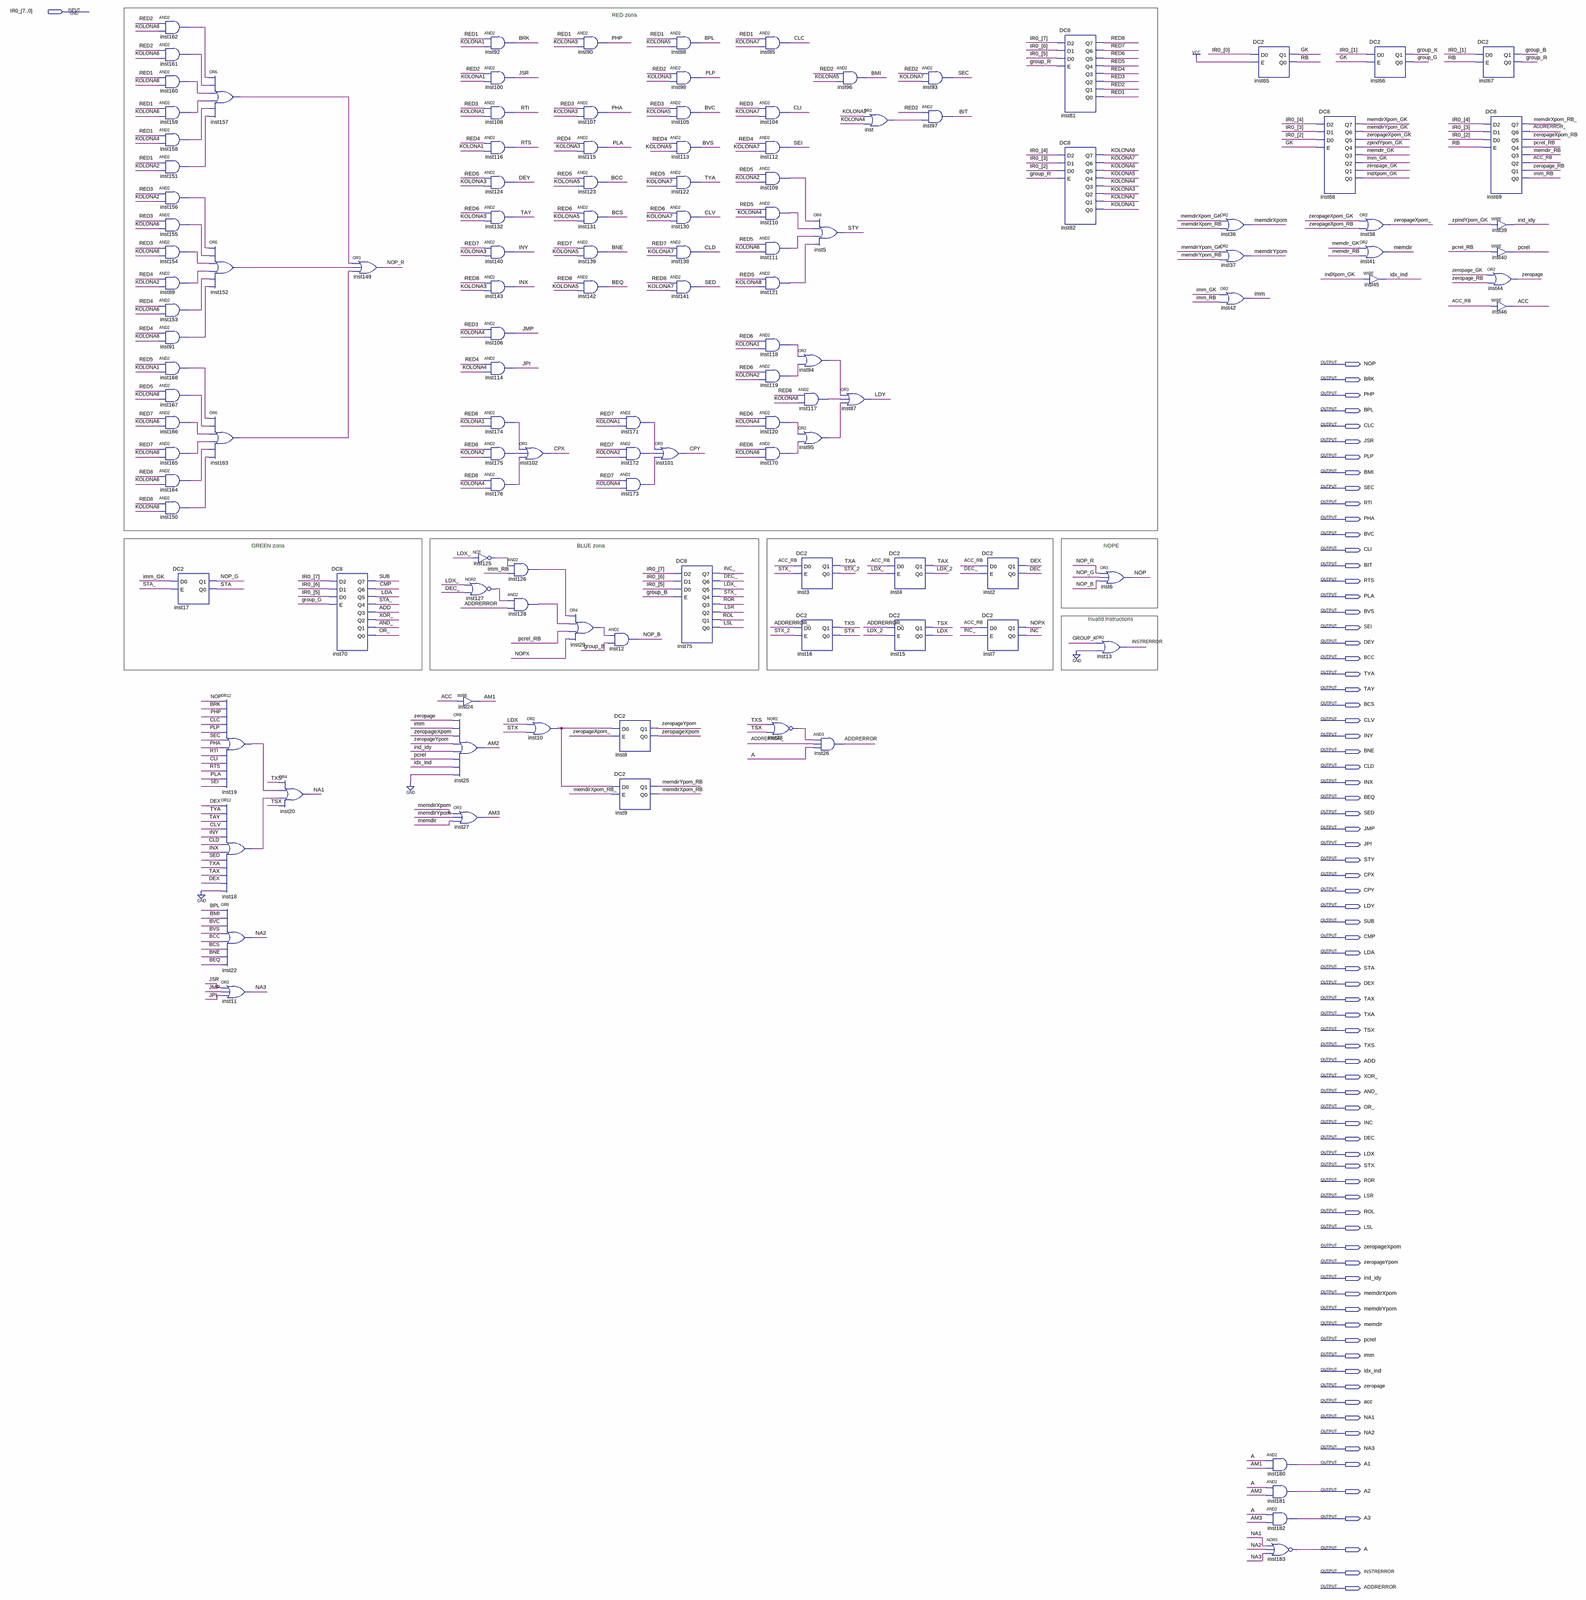
[diagram p0: schematic sheet, whole]
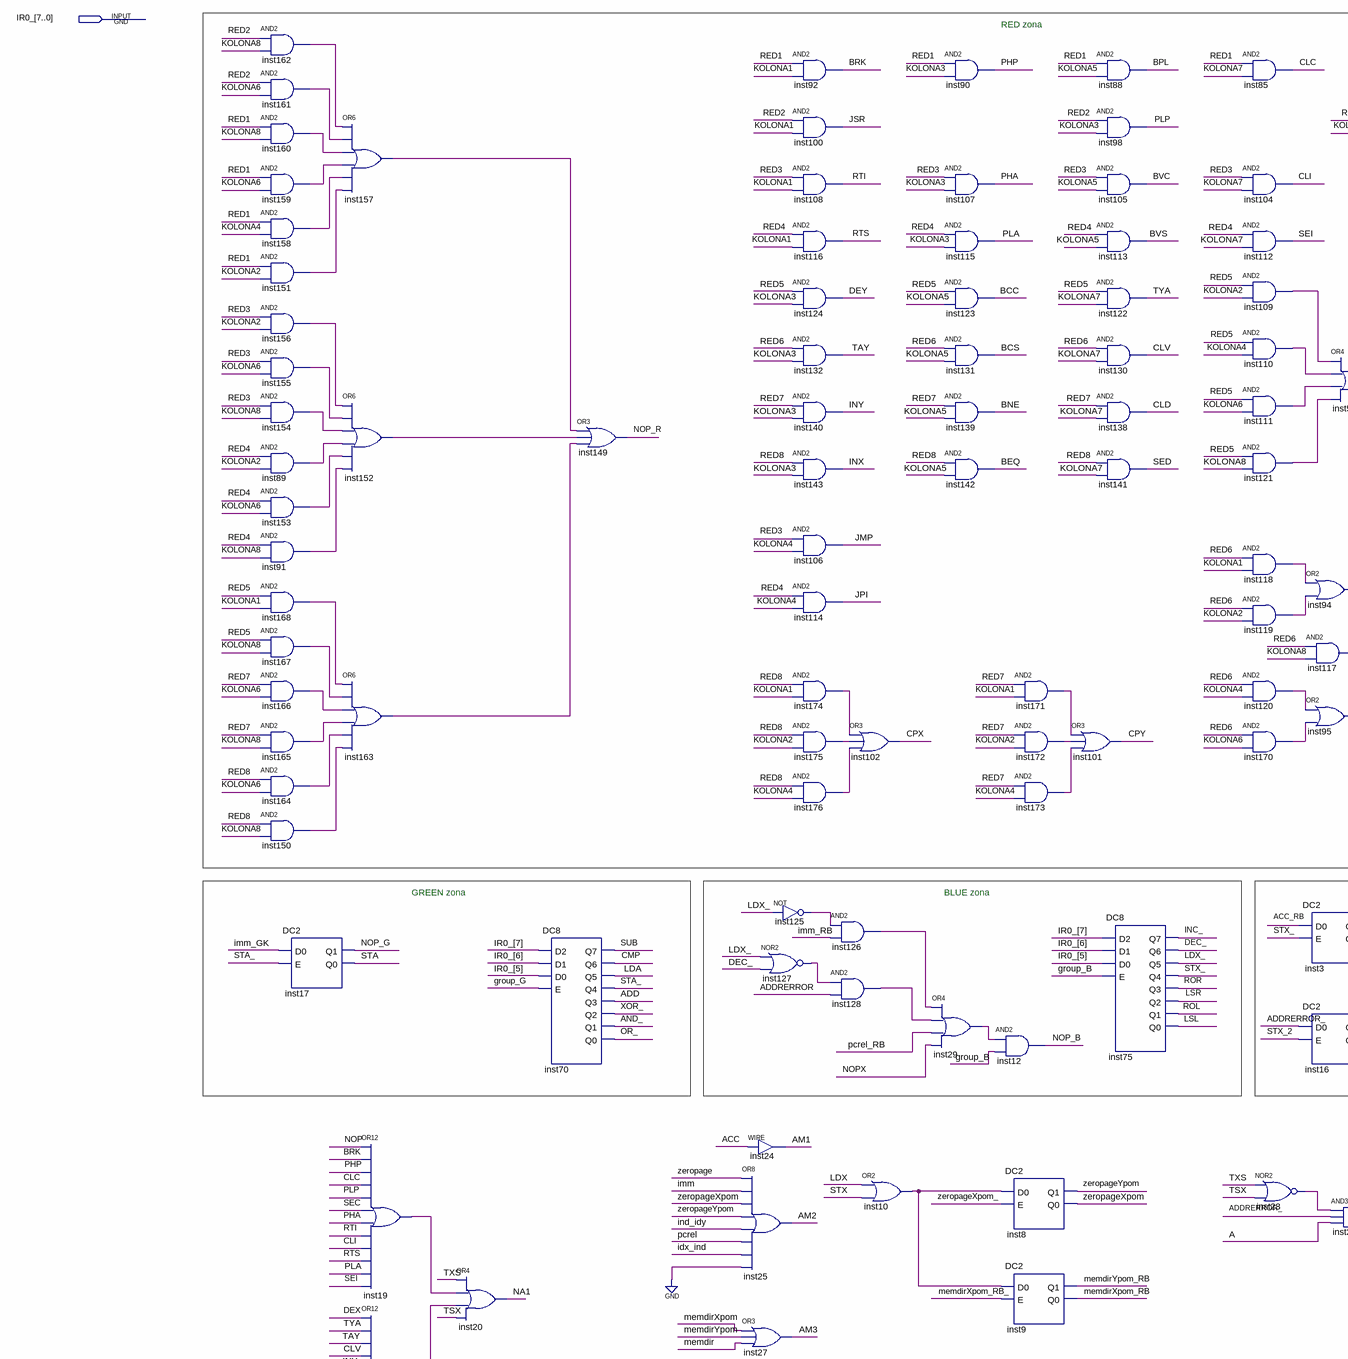
[diagram p1: schematic sheet, upper left part]
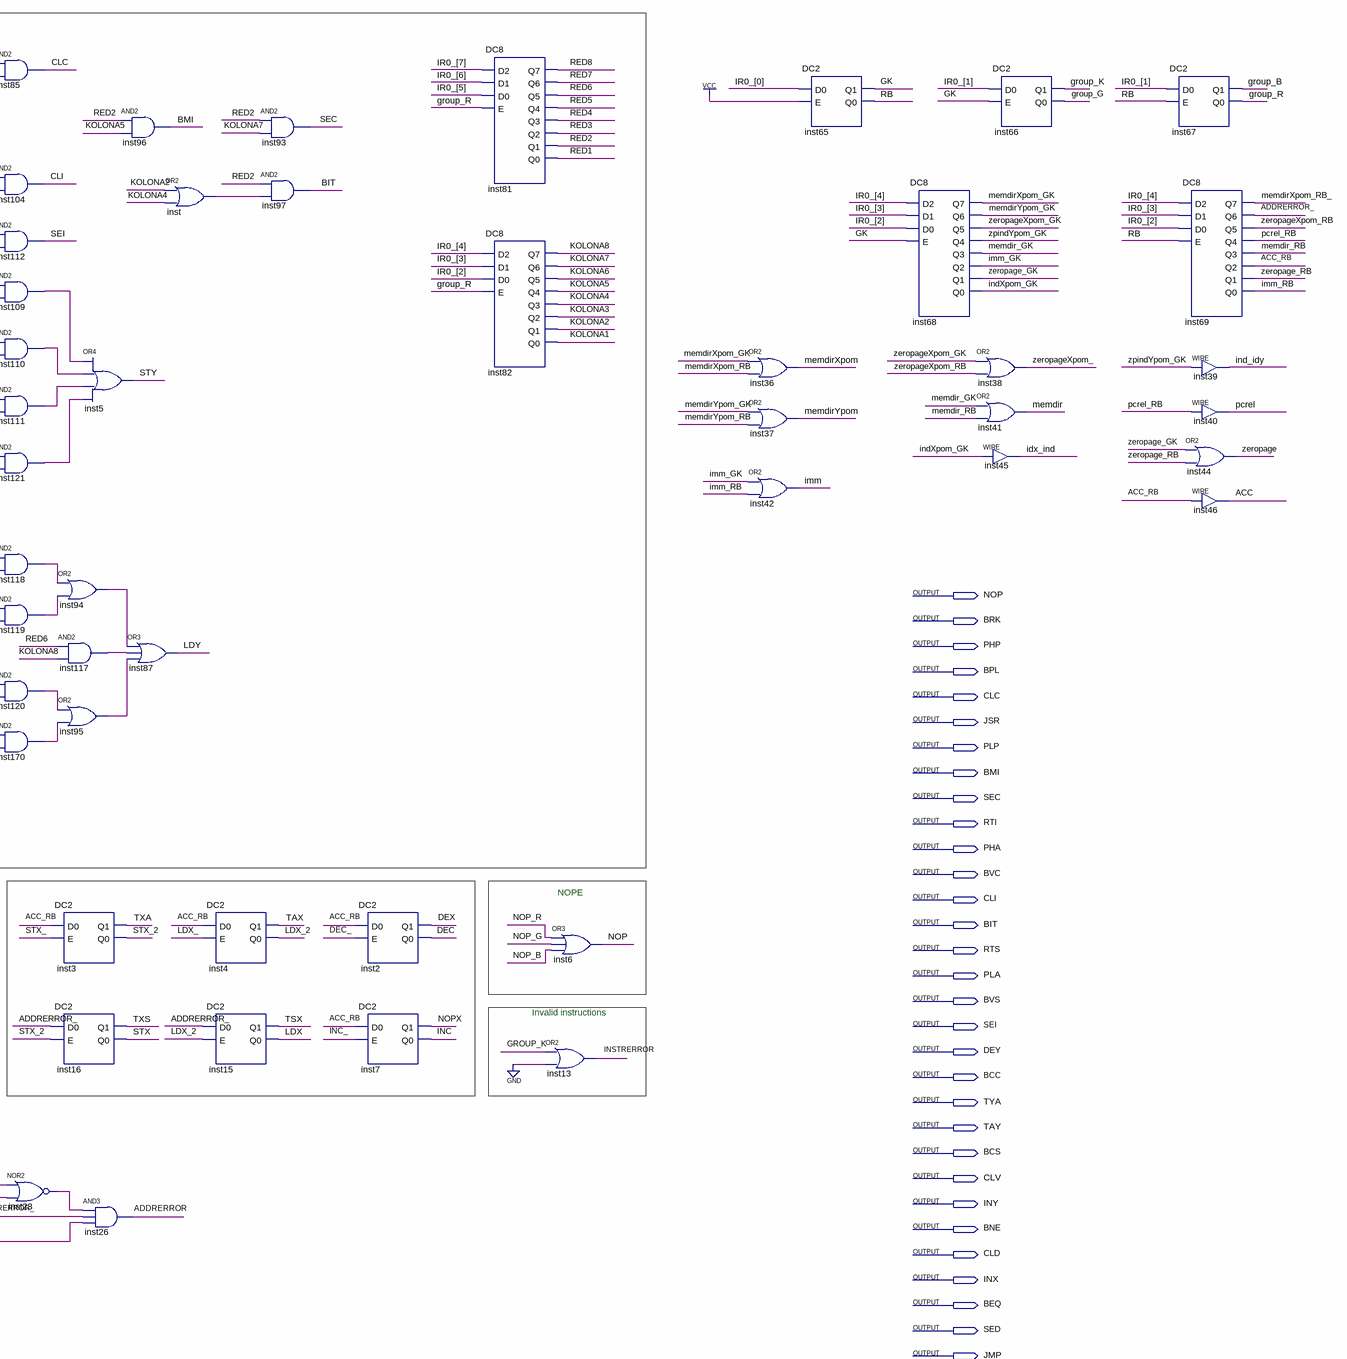
[diagram p2: schematic sheet, upper right part]
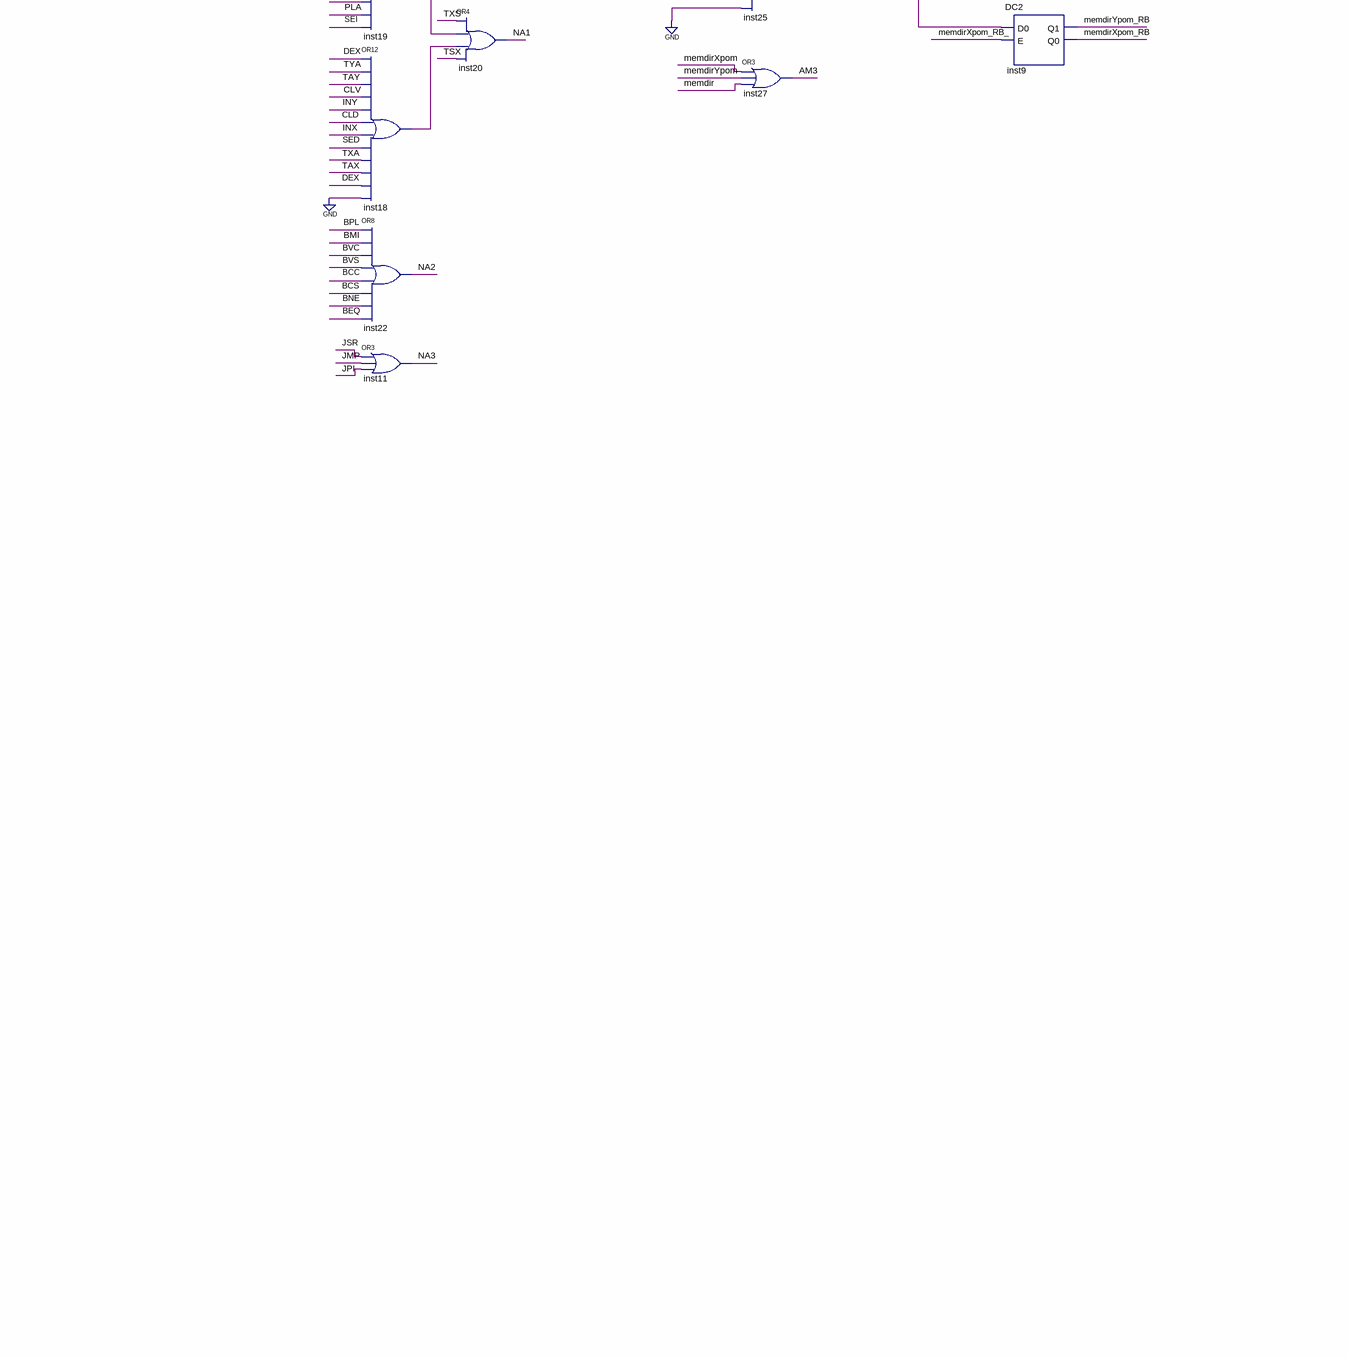
[diagram p3: schematic sheet, lower left part]
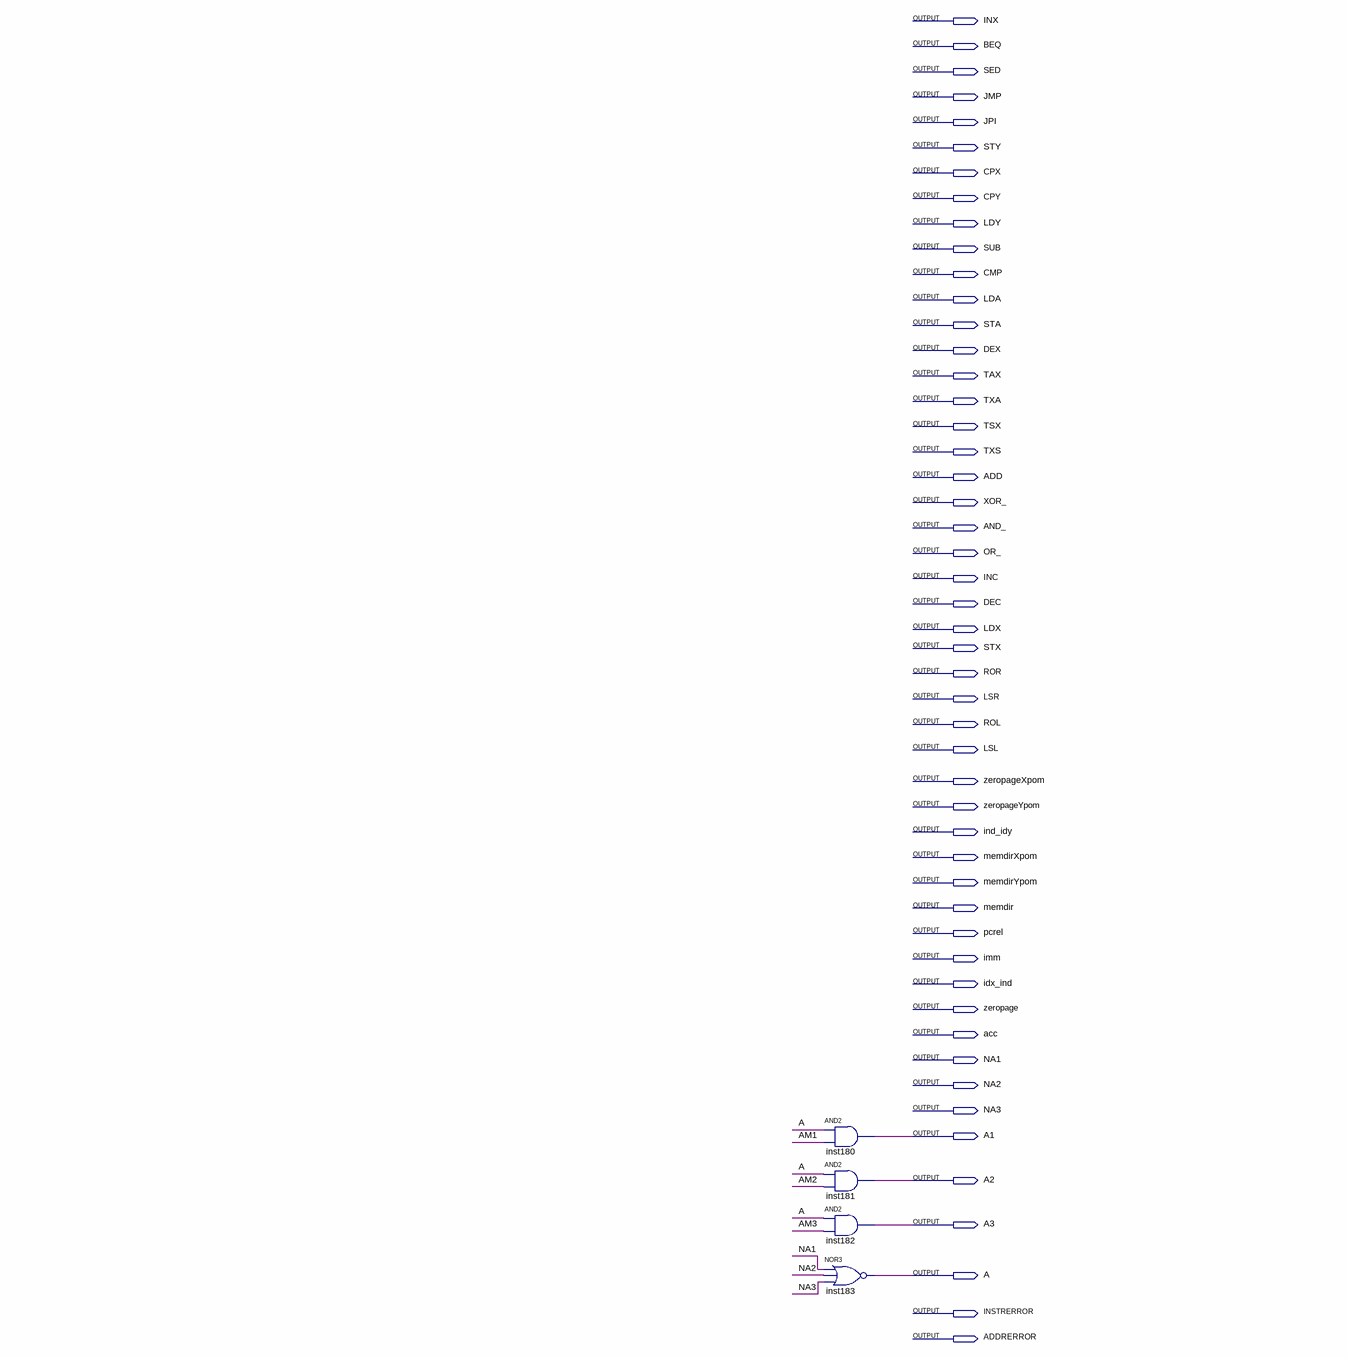
[diagram p4: schematic sheet, lower right part]
// Quartus schematic cpu_decode.bdf as structural Verilog: 126 symbols, 78 pins
module cpu_decode (
  input  [7:0] IR0_,
  output NOP,
  output BRK,
  output PHP,
  output BPL,
  output CLC,
  output JSR,
  output PLP,
  output BMI,
  output SEC,
  output RTI,
  output PHA,
  output BVC,
  output CLI,
  output BIT,
  output RTS,
  output PLA,
  output BVS,
  output SEI,
  output DEY,
  output BCC,
  output TYA,
  output TAY,
  output BCS,
  output CLV,
  output INY,
  output BNE,
  output CLD,
  output INX,
  output BEQ,
  output SED,
  output JMP,
  output JPI,
  output STY,
  output CPX,
  output CPY,
  output LDY,
  output SUB,
  output CMP,
  output LDA,
  output STA,
  output DEX,
  output TAX,
  output TXA,
  output TSX,
  output TXS,
  output ADD,
  output XOR_,
  output AND_,
  output OR_,
  output INC,
  output DEC,
  output LDX,
  output STX,
  output ROR,
  output LSR,
  output ROL,
  output LSL,
  output zeropageXpom,
  output zeropageYpom,
  output ind_idy,
  output memdirXpom,
  output memdirYpom,
  output memdir,
  output pcrel,
  output imm,
  output idx_ind,
  output zeropage,
  output acc,
  output NA1,
  output NA2,
  output NA3,
  output A1,
  output A2,
  output A3,
  output A,
  output INSTRERROR,
  output ADDRERROR
);

  wire ACC_RB, ADDRERROR_, AM1, AM2, AM3, DEC_, GK, group_B, group_G, group_K, group_R, imm_GK, imm_RB, INC_,
       indXpom_GK, inst10_out, inst18_out, inst19_out, inst23_out, inst29_out, inst89_out, inst91_out,
       inst94_out, inst95_out, inst109_out, inst110_out, inst111_out, inst117_out, inst118_out, inst119_out,
       inst120_out, inst121_out, inst125_out, inst126_out, inst127_out, inst128_out, inst150_out,
       inst151_out, inst152_out, inst153_out, inst154_out, inst155_out, inst156_out, inst157_out,
       inst158_out, inst159_out, inst160_out, inst161_out, inst162_out, inst163_out, inst164_out,
       inst165_out, inst166_out, inst167_out, inst168_out, inst170_out, inst171_out, inst172_out,
       inst173_out, inst174_out, inst175_out, inst176_out, inst_out, KOLONA1, KOLONA2, KOLONA3, KOLONA4,
       KOLONA5, KOLONA6, KOLONA7, KOLONA8, LDX_, LDX_2, memdir_GK, memdir_RB, memdirXpom_GK, memdirXpom_RB,
       memdirXpom_RB_, memdirYpom_GK, memdirYpom_RB, NOP_B, NOP_G, NOP_R, NOPX, pcrel_RB, RB, RED1, RED2,
       RED3, RED4, RED5, RED6, RED7, RED8, STA_, STX_, STX_2, zeropage_GK, zeropage_RB, zeropageXpom_,
       zeropageXpom_GK, zeropageXpom_RB, zpindYpom_GK;

  and inst162 (inst162_out, RED2, KOLONA8);
  and inst161 (inst161_out, RED2, KOLONA6);
  and inst160 (inst160_out, RED1, KOLONA8);
  and inst159 (inst159_out, RED1, KOLONA6);
  and inst158 (inst158_out, RED1, KOLONA4);
  and inst151 (inst151_out, RED1, KOLONA2);
  and inst156 (inst156_out, RED3, KOLONA2);
  and inst155 (inst155_out, RED3, KOLONA6);
  and inst154 (inst154_out, RED3, KOLONA8);
  and inst89 (inst89_out, RED4, KOLONA2);
  and inst153 (inst153_out, RED4, KOLONA6);
  and inst91 (inst91_out, RED4, KOLONA8);
  and inst168 (inst168_out, RED5, KOLONA1);
  and inst167 (inst167_out, RED5, KOLONA8);
  and inst166 (inst166_out, RED7, KOLONA6);
  and inst165 (inst165_out, RED7, KOLONA8);
  and inst164 (inst164_out, RED8, KOLONA6);
  and inst150 (inst150_out, RED8, KOLONA8);
  DC2 inst17 (.D0(imm_GK), .E(STA_), .Q1(NOP_G), .Q0(STA));
  or inst157 (inst157_out, inst162_out, inst161_out, inst160_out, inst159_out, inst158_out, inst151_out);
  or inst152 (inst152_out, inst156_out, inst155_out, inst154_out, inst89_out, inst153_out, inst91_out);
  or inst163 (inst163_out, inst168_out, inst167_out, inst166_out, inst165_out, inst164_out, inst150_out);
  or inst19 (inst19_out, NOP, BRK, PHP, CLC, PLP, SEC, PHA, RTI, CLI, RTS, PLA, SEI);
  or inst18 (inst18_out, DEX, TYA, TAY, CLV, INY, CLD, INX, SED, TXA, TAX, DEX, 1'b0);
  or inst22 (NA2, BPL, BMI, BVC, BVS, BCC, BCS, BNE, BEQ);
  or inst11 (NA3, JSR, JMP, JPI);
  or inst20 (NA1, TXS, inst19_out, inst18_out, TSX);
  DC8 inst70 (
    .D2(IR0_[7]), .D1(IR0_[6]), .D0(IR0_[5]), .E(group_G), .Q7(SUB), .Q6(CMP), .Q5(LDA), .Q4(STA_), .Q3(ADD),
    .Q2(XOR_), .Q1(AND_), .Q0(OR_));
  or inst149 (NOP_R, inst157_out, inst152_out, inst163_out);
  or inst25 (AM2, zeropage, imm, zeropageXpom, zeropageYpom, ind_idy, pcrel, idx_ind, 1'b0);
  or inst27 (AM3, memdirXpom, memdirYpom, memdir);
  and inst92 (BRK, RED1, KOLONA1);
  and inst100 (JSR, RED2, KOLONA1);
  and inst108 (RTI, RED3, KOLONA1);
  and inst116 (RTS, RED4, KOLONA1);
  and inst124 (DEY, RED5, KOLONA3);
  and inst132 (TAY, RED6, KOLONA3);
  and inst140 (INY, RED7, KOLONA3);
  and inst143 (INX, RED8, KOLONA3);
  and inst106 (JMP, RED3, KOLONA4);
  and inst114 (JPI, RED4, KOLONA4);
  and inst174 (inst174_out, RED8, KOLONA1);
  and inst175 (inst175_out, RED8, KOLONA2);
  and inst176 (inst176_out, RED8, KOLONA4);
  not inst125 (inst125_out, LDX_);
  nor inst127 (inst127_out, LDX_, DEC_);
  assign AM1 = acc;  // WIRE inst24
  and inst126 (inst126_out, inst125_out, imm_RB);
  and inst128 (inst128_out, inst127_out, ADDRERROR);
  or inst102 (CPX, inst174_out, inst175_out, inst176_out);
  or inst10 (inst10_out, LDX, STX);
  and inst90 (PHP, RED1, KOLONA3);
  and inst107 (PHA, RED3, KOLONA3);
  and inst115 (PLA, RED4, KOLONA3);
  and inst123 (BCC, RED5, KOLONA5);
  and inst131 (BCS, RED6, KOLONA5);
  and inst139 (BNE, RED7, KOLONA5);
  and inst142 (BEQ, RED8, KOLONA5);
  or inst29 (inst29_out, inst126_out, inst128_out, pcrel_RB, NOPX);
  and inst12 (NOP_B, inst29_out, group_B);
  and inst171 (inst171_out, RED7, KOLONA1);
  and inst172 (inst172_out, RED7, KOLONA2);
  and inst173 (inst173_out, RED7, KOLONA4);
  DC2 inst8 (.D0(inst10_out), .E(zeropageXpom_), .Q1(zeropageYpom), .Q0(zeropageXpom));
  DC2 inst9 (.D0(inst10_out), .E(memdirXpom_RB_), .Q1(memdirYpom_RB), .Q0(memdirXpom_RB));
  and inst88 (BPL, RED1, KOLONA5);
  and inst98 (PLP, RED2, KOLONA3);
  and inst105 (BVC, RED3, KOLONA5);
  and inst113 (BVS, RED4, KOLONA5);
  and inst122 (TYA, RED5, KOLONA7);
  and inst130 (CLV, RED6, KOLONA7);
  and inst138 (CLD, RED7, KOLONA7);
  and inst141 (SED, RED8, KOLONA7);
  or inst101 (CPY, inst171_out, inst172_out, inst173_out);
  DC8 inst75 (
    .D2(IR0_[7]), .D1(IR0_[6]), .D0(IR0_[5]), .E(group_B), .Q7(INC_), .Q6(DEC_), .Q5(LDX_), .Q4(STX_),
    .Q3(ROR), .Q2(LSR), .Q1(ROL), .Q0(LSL));
  and inst85 (CLC, RED1, KOLONA7);
  and inst104 (CLI, RED3, KOLONA7);
  and inst112 (SEI, RED4, KOLONA7);
  and inst109 (inst109_out, RED5, KOLONA2);
  and inst110 (inst110_out, RED5, KOLONA4);
  and inst111 (inst111_out, RED5, KOLONA6);
  and inst121 (inst121_out, RED5, KOLONA8);
  and inst118 (inst118_out, RED6, KOLONA1);
  and inst119 (inst119_out, RED6, KOLONA2);
  and inst120 (inst120_out, RED6, KOLONA4);
  and inst170 (inst170_out, RED6, KOLONA6);
  DC2 inst3 (.D0(ACC_RB), .E(STX_), .Q1(TXA), .Q0(STX_2));
  DC2 inst16 (.D0(ADDRERROR_), .E(STX_2), .Q1(TXS), .Q0(STX));
  nor inst23 (inst23_out, TXS, TSX);
  or inst5 (STY, inst109_out, inst110_out, inst111_out, inst121_out);
  or inst94 (inst94_out, inst118_out, inst119_out);
  and inst117 (inst117_out, RED6, KOLONA8);
  or inst95 (inst95_out, inst120_out, inst170_out);
  and inst26 (ADDRERROR, inst23_out, ADDRERROR_, A);
  and inst96 (BMI, RED2, KOLONA5);
  or inst87 (LDY, inst94_out, inst117_out, inst95_out);
  or inst (inst_out, KOLONA2, KOLONA4);
  DC2 inst4 (.D0(ACC_RB), .E(LDX_), .Q1(TAX), .Q0(LDX_2));
  DC2 inst15 (.D0(ADDRERROR_), .E(LDX_2), .Q1(TSX), .Q0(LDX));
  and inst93 (SEC, RED2, KOLONA7);
  and inst97 (BIT, RED2, inst_out);
  DC2 inst2 (.D0(ACC_RB), .E(DEC_), .Q1(DEX), .Q0(DEC));
  DC2 inst7 (.D0(ACC_RB), .E(INC_), .Q1(NOPX), .Q0(INC));
  DC8 inst81 (
    .D2(IR0_[7]), .D1(IR0_[6]), .D0(IR0_[5]), .E(group_R), .Q7(RED8), .Q6(RED7), .Q5(RED6), .Q4(RED5),
    .Q3(RED4), .Q2(RED3), .Q1(RED2), .Q0(RED1));
  DC8 inst82 (
    .D2(IR0_[4]), .D1(IR0_[3]), .D0(IR0_[2]), .E(group_R), .Q7(KOLONA8), .Q6(KOLONA7), .Q5(KOLONA6),
    .Q4(KOLONA5), .Q3(KOLONA4), .Q2(KOLONA3), .Q1(KOLONA2), .Q0(KOLONA1));
  or inst6 (NOP, NOP_R, NOP_G, NOP_B);
  or inst13 (INSTRERROR, group_K, 1'b0);
  or inst36 (memdirXpom, memdirXpom_GK, memdirXpom_RB);
  or inst37 (memdirYpom, memdirYpom_GK, memdirYpom_RB);
  or inst42 (imm, imm_GK, imm_RB);
  DC2 inst65 (.D0(IR0_[0]), .E(1'b1), .Q1(GK), .Q0(RB));
  and inst180 (A1, A, AM1);
  and inst181 (A2, A, AM2);
  and inst182 (A3, A, AM3);
  nor inst183 (A, NA1, NA2, NA3);
  DC8 inst68 (
    .D2(IR0_[4]), .D1(IR0_[3]), .D0(IR0_[2]), .E(GK), .Q7(memdirXpom_GK), .Q6(memdirYpom_GK),
    .Q5(zeropageXpom_GK), .Q4(zpindYpom_GK), .Q3(memdir_GK), .Q2(imm_GK), .Q1(zeropage_GK), .Q0(indXpom_GK));
  DC2 inst66 (.D0(IR0_[1]), .E(GK), .Q1(group_K), .Q0(group_G));
  or inst38 (zeropageXpom_, zeropageXpom_GK, zeropageXpom_RB);
  or inst41 (memdir, memdir_GK, memdir_RB);
  assign idx_ind = indXpom_GK;  // WIRE inst45
  DC2 inst67 (.D0(IR0_[1]), .E(RB), .Q1(group_B), .Q0(group_R));
  DC8 inst69 (
    .D2(IR0_[4]), .D1(IR0_[3]), .D0(IR0_[2]), .E(RB), .Q7(memdirXpom_RB_), .Q6(ADDRERROR_),
    .Q5(zeropageXpom_RB), .Q4(pcrel_RB), .Q3(memdir_RB), .Q2(ACC_RB), .Q1(zeropage_RB), .Q0(imm_RB));
  assign ind_idy = zpindYpom_GK;  // WIRE inst39
  assign pcrel = pcrel_RB;  // WIRE inst40
  or inst44 (zeropage, zeropage_GK, zeropage_RB);
  assign acc = ACC_RB;  // WIRE inst46

  // Notes on the sheet:
  //   RED zona
  //   GREEN zona
  //   BLUE zona
  //   NOPE
  //   Invalid instructions
endmodule
